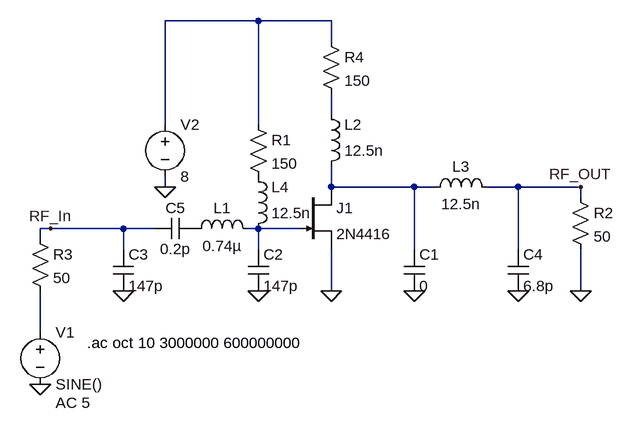
[diagram p0: schematic amp_filter_433MHz.asc]
amp_filter_433MHz.asc, the LTspice schematic file:
Version 4
SHEET 1 880 680
WIRE 192 -192 48 -192
WIRE 304 -192 192 -192
WIRE 304 -160 304 -192
WIRE 304 -48 304 -80
WIRE 48 -32 48 -192
WIRE 192 -32 192 -192
WIRE 48 64 48 48
WIRE 304 64 304 32
WIRE 432 64 304 64
WIRE 464 64 432 64
WIRE 592 64 544 64
WIRE 688 64 592 64
WIRE 304 80 304 64
WIRE 688 80 688 64
WIRE -128 128 -144 128
WIRE -16 128 -128 128
WIRE 32 128 -16 128
WIRE 192 128 176 128
WIRE 256 128 192 128
WIRE -144 144 -144 128
WIRE -16 160 -16 128
WIRE 192 160 192 128
WIRE 432 160 432 64
WIRE 592 160 592 64
WIRE 304 224 304 160
WIRE 688 224 688 160
WIRE -144 288 -144 224
FLAG 192 224 0
FLAG 592 224 0
FLAG 304 224 0
FLAG -144 368 0
FLAG -128 128 RF_In
FLAG 432 224 0
FLAG 688 224 0
FLAG 688 64 RF_OUT
FLAG 48 64 0
FLAG -16 224 0
SYMBOL cap 176 160 R0
SYMATTR InstName C2
SYMATTR Value 147p
SYMBOL ind 80 144 R270
WINDOW 0 32 56 VTop 2
WINDOW 3 5 56 VBottom 2
SYMATTR InstName L1
SYMATTR Value 0.74µ
SYMBOL ind 288 48 M180
WINDOW 0 36 80 Left 2
WINDOW 3 36 40 Left 2
SYMATTR InstName L2
SYMATTR Value 12.5n
SYMBOL ind 448 80 R270
WINDOW 0 32 56 VTop 2
WINDOW 3 5 56 VBottom 2
SYMATTR InstName L3
SYMATTR Value 12.5n
SYMBOL cap 576 160 R0
SYMATTR InstName C4
SYMATTR Value 6.8p
SYMBOL njf 256 64 R0
SYMATTR InstName J1
SYMATTR Value 2N4416
SYMBOL voltage -144 272 R0
WINDOW 123 24 124 Left 2
WINDOW 39 0 0 Left 2
SYMATTR InstName V1
SYMATTR Value SINE()
SYMATTR Value2 AC 5
SYMBOL cap 416 160 R0
SYMATTR InstName C1
SYMATTR Value 0
SYMBOL res 672 64 R0
SYMATTR InstName R2
SYMATTR Value 50
SYMBOL res -160 128 R0
SYMATTR InstName R3
SYMATTR Value 50
SYMBOL voltage 48 -48 R0
WINDOW 123 0 0 Left 2
WINDOW 39 0 0 Left 2
SYMATTR InstName V2
SYMATTR Value 8
SYMBOL res 176 -48 R0
SYMATTR InstName R1
SYMATTR Value 150
SYMBOL res 288 -176 R0
SYMATTR InstName R4
SYMATTR Value 150
SYMBOL ind 176 144 M180
WINDOW 0 36 80 Left 2
WINDOW 3 36 40 Left 2
SYMATTR InstName L4
SYMATTR Value 12.5n
SYMBOL cap -32 160 R0
SYMATTR InstName C3
SYMATTR Value 147p
SYMBOL cap 96 112 R90
WINDOW 0 0 32 VBottom 2
WINDOW 3 32 32 VTop 2
SYMATTR InstName C5
SYMATTR Value 0.2p
TEXT -72 304 Left 2 !.ac oct 10 3000000 600000000

The netlist it stands for:
* amp_filter_433MHz.asc
C2 N004 0 147p
L1 P001 N004 0.74µ
L2 N003 N002 12.5n
L3 N003 RF_OUT 12.5n
C4 RF_OUT 0 6.8p
J1 N003 N004 0 2N4416
V1 N005 0 SINE() AC 5
C1 N003 0 0
R2 RF_OUT 0 50
R3 RF_In N005 50
V2 N001 0 8
R1 N001 P002 150
R4 N001 N002 150
L4 N004 P002 12.5n
C3 RF_In 0 147p
C5 P001 RF_In 0.2p
.model NJF NJF
.model PJF PJF
.lib standard.jft
.ac oct 10 3000000 600000000
.backanno
.end